# EasyEDA Pro project EasyEDAProDoc_P2303U1-electronicbox_2024-09-11.epro

# Schematic P2303U1-electronicbox
Board Name: P2303U1-main; Create Date: 2023-04-14; Company: Urli Lab; Part Number: P2303U1; Version: V1.0
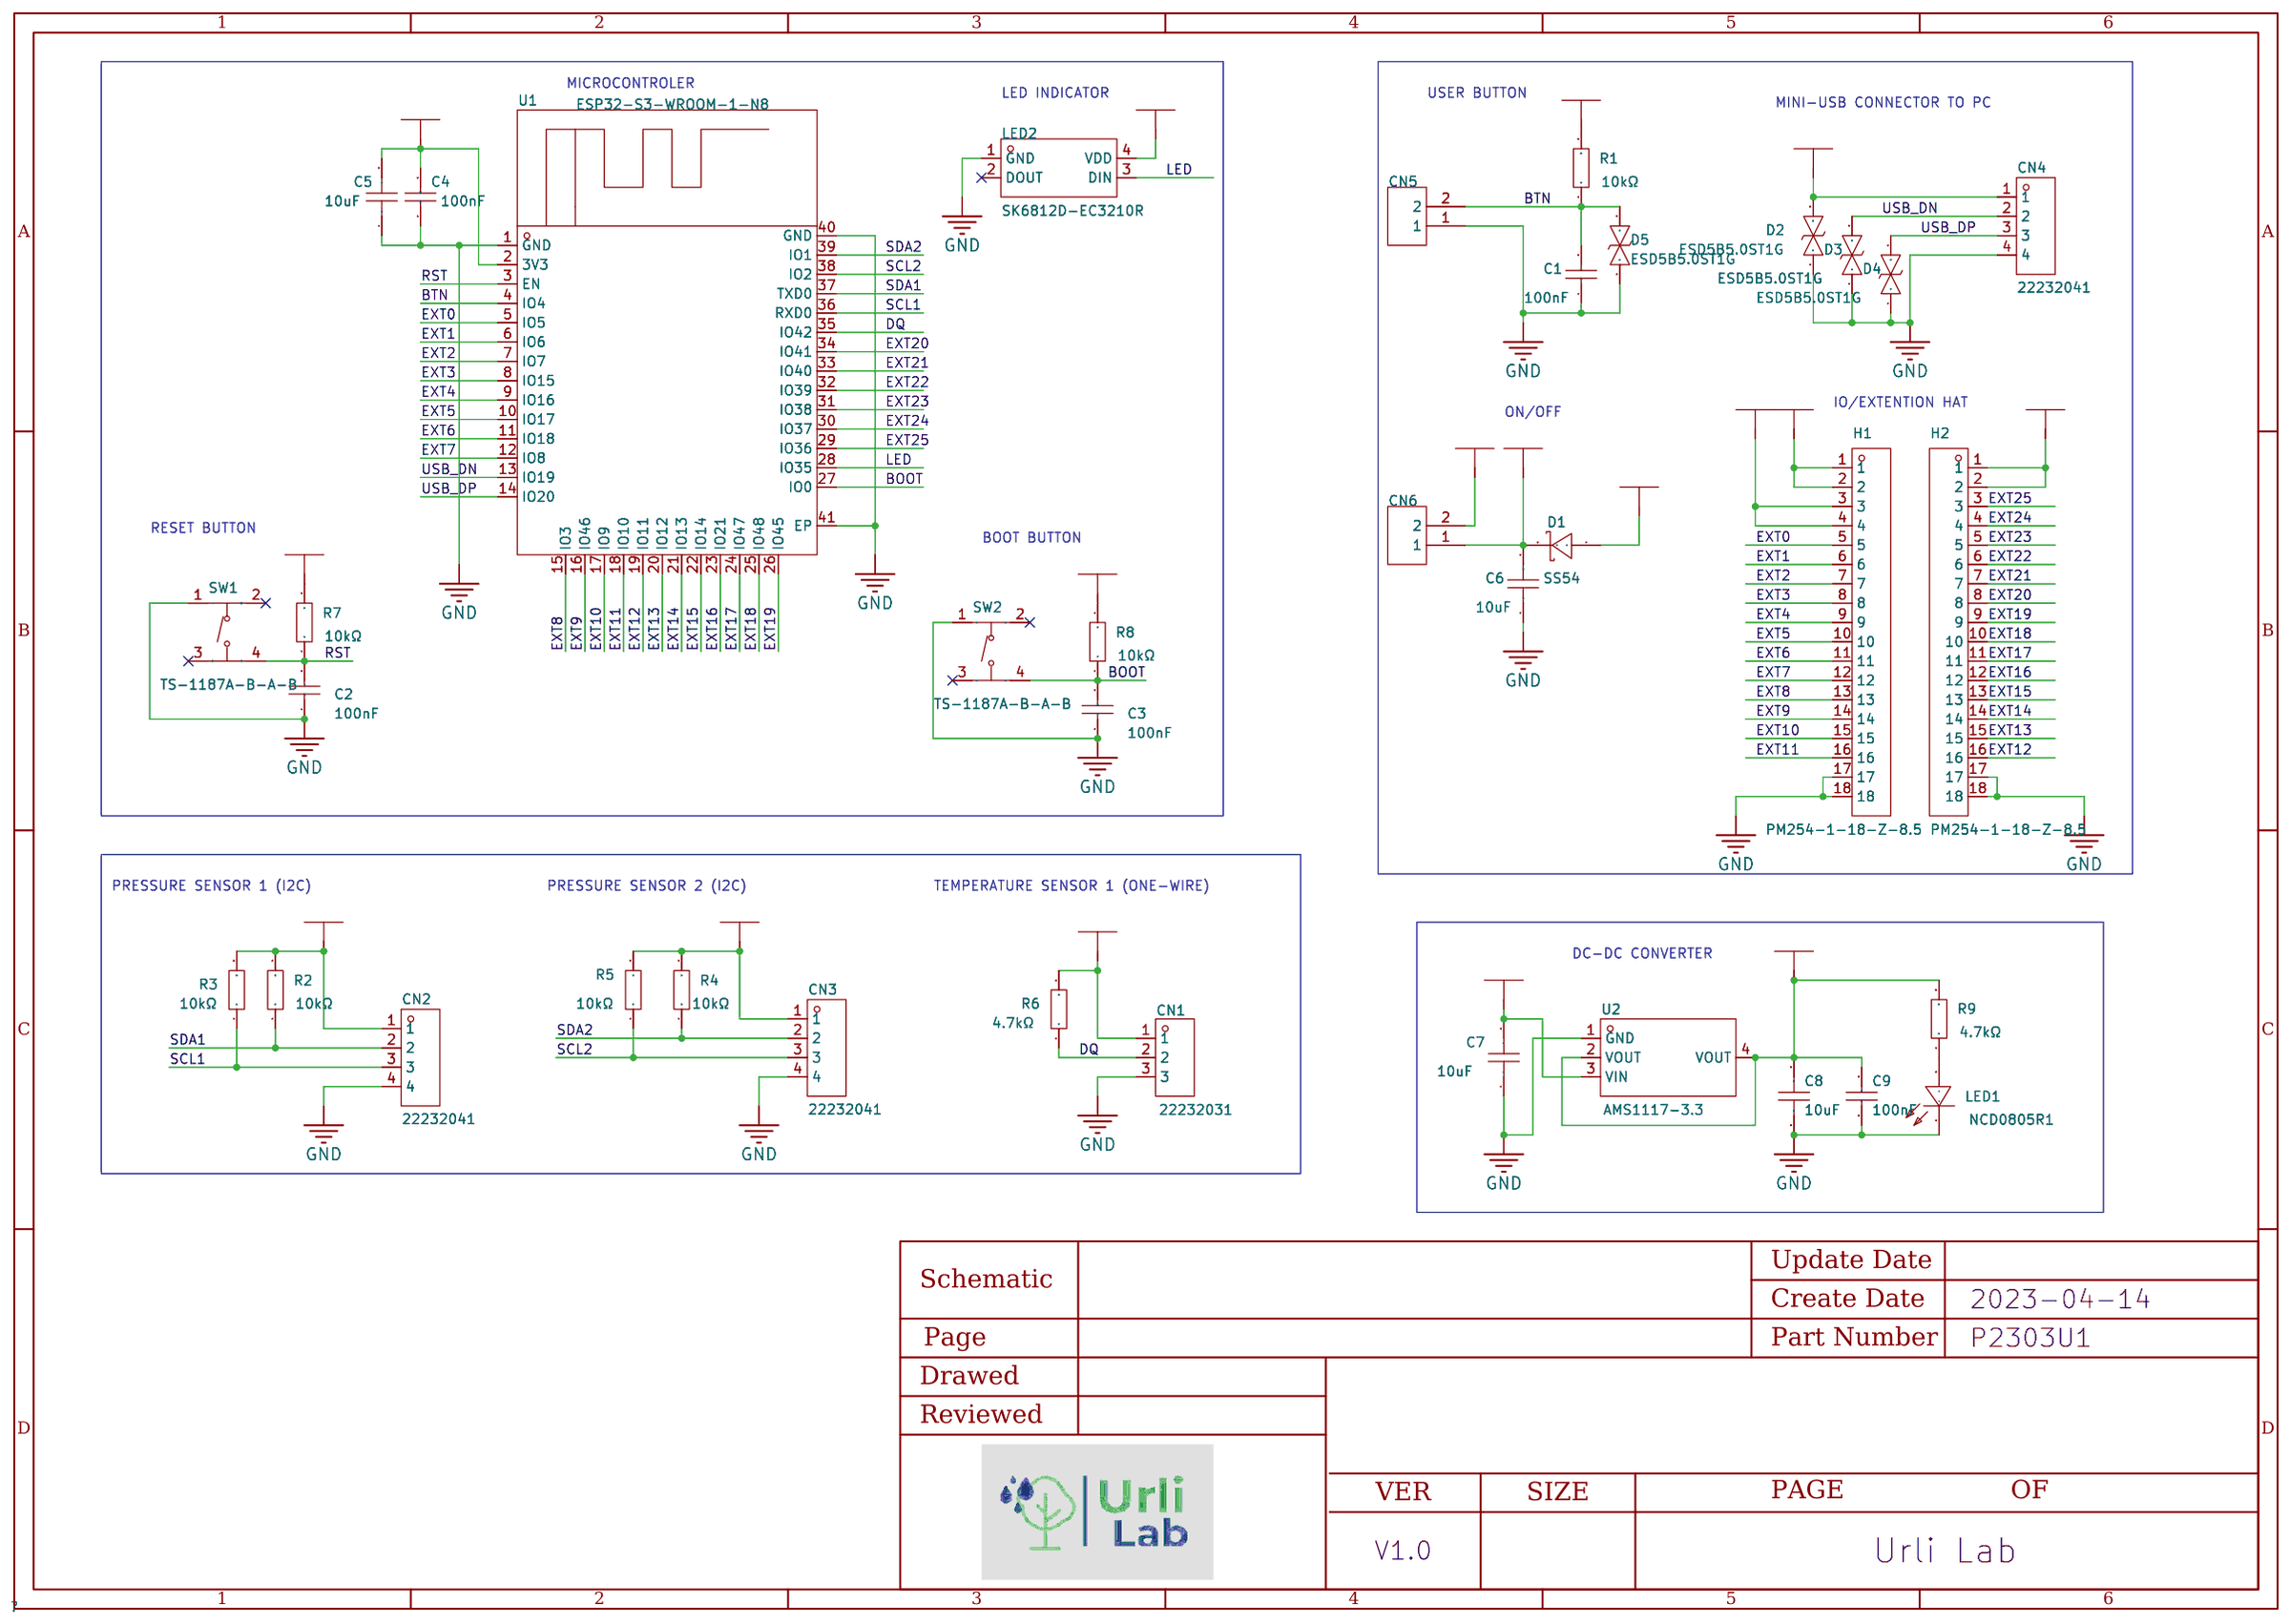
[diagram p0: schematic sheet]

## Parts
C1  100nF  [C0805]
C2  100nF  [C0805]
C3  100nF  [C0805]
C4  100nF  [C0805]
C5  10uF  [C0805]
C6  10uF  [C0805]
C7  10uF  [C0805]
C8  10uF  [C0805]
C9  100nF  [C0805]
CN1  22232031  [CONN-TH_3P-P2.54_22-23-2031]
CN2  22232041  [CONN-TH_4P-P2.54_22232041]
CN3  22232041  [CONN-TH_4P-P2.54_22232041]
CN4  22232041  [CONN-TH_4P-P2.54_22232041]
CN5  22-23-2021  [Molex-22-23-2021-Manufacturer_Recommended]
CN6  22-23-2021  [Molex-22-23-2021-Manufacturer_Recommended]
D1  SS54  [SMA_L4.4-W2.8-LS5.4-R-RD]
D2  ESD5B5.0ST1G  [SOD-523_L1.2-W0.8-LS1.6-BI]
D3  ESD5B5.0ST1G  [SOD-523_L1.2-W0.8-LS1.6-BI]
D4  ESD5B5.0ST1G  [SOD-523_L1.2-W0.8-LS1.6-BI]
D5  ESD5B5.0ST1G  [SOD-523_L1.2-W0.8-LS1.6-BI]
H1  PM254-1-18-Z-8.5  [HDR-TH_18P-P2.54-V-F]
H2  PM254-1-18-Z-8.5  [HDR-TH_18P-P2.54-V-F]
LED1  NCD0805R1  [LED0805-RD_RED]
LED2  SK6812D-EC3210R  [LED-SMD_4P_SK6812D-EC3210R]
R1  10kΩ  [R0805]
R2  10kΩ  [R0805]
R3  10kΩ  [R0805]
R4  10kΩ  [R0805]
R5  10kΩ  [R0805]
R6  4.7kΩ  [R0805]
R7  10kΩ  [R0805]
R8  10kΩ  [R0805]
R9  4.7kΩ  [R0805]
SW1  TS-1187A-B-A-B  [SW-SMD_4P-L5.1-W5.1-P3.70-LS6.5-TL-2]
SW2  TS-1187A-B-A-B  [SW-SMD_4P-L5.1-W5.1-P3.70-LS6.5-TL-2]
U1  ESP32-S3-WROOM-1-N8  [WIFIM-SMD_ESP32-S3-WROOM-1-N8]
U2  AMS1117-3.3  [SOT-223-3_L6.5-W3.4-P2.30-LS7.0-BR]

## Library data of the parts
C1-C4 C9 = CC0805KRX7R9BB104: Capacitance: Tolerance:±10% Tolerance:±10% Voltage Rated: Temperature Coefficient:; LCSC Part Name: 100nF ±10% 50V; Supplier Part: C49678; Manufacturer: YAGEO(国巨); Supplier Footprint: 0805; JLCPCB Part Class: Basic Part; Datasheet: https://atta.szlcsc.com/upload/public/pdf/source/20151026/1457707504898.pdf; Supplier: LCSC; Tolerance: ±10%
C5-C8 = GRM21BR61H106KE43L: Capacitance: Tolerance:±10% Tolerance:±10% Voltage Rated: Temperature Coefficient:; LCSC Part Name: 10uF ±10% 50V; Supplier Part: C440198; Manufacturer: muRata(村田); Supplier Footprint: 0805; JLCPCB Part Class: Basic Part; Datasheet: https://atta.szlcsc.com/upload/public/pdf/source/20191220/C440198_2DEA1B9834E321C8893F7972E9DFE5B0.pdf; Supplier: LCSC; Tolerance: ±10%
CN1 = 22232031: Reference Series:- Pitch:2.54mm Pins Structure:1x3P Number of Rows:1 Number of PINs Per Row:3 Row Spacing:- Mounting Style:- Contact Material:Brass; LCSC Part Name: 2.54mm 1x3P; Supplier Part: C234181; Manufacturer: MOLEX; Supplier Footprint: 直插,P=2.54mm; JLCPCB Part Class: Extended Part; Datasheet: https://atta.szlcsc.com/upload/public/pdf/source/20190912/C234181_096A3D100CF5A4413B41D2108E533DE6.pdf; Supplier: LCSC; Pitch: 2.54mm; Pins Structure: 1x3P; Number of Rows: 1; Number of PINs Per Row: 3; Contact Material: Brass
CN2-CN4 = 22232041: Reference Series:- Pitch:2.54mm Pins Structure:1x4P Number of Rows:1 Number of PINs Per Row:4 Row Spacing:- Gender:公型插针 Mounting Style:Straight Current Rating (Max):- Operating Temperature Range:- Operating Temperature Range:-; LCSC Part Name: 2.54mm 1x4P 直插; Supplier Part: C164168; Manufacturer: MOLEX; Supplier Footprint: 直插,P=2.54mm; JLCPCB Part Class: Extended Part; Datasheet: https://atta.szlcsc.com/upload/public/pdf/source/20180524/C164168_14DE6A7B55FCA9396291F18B21842201.pdf; Supplier: LCSC; Pitch: 2.54mm; Pins Structure: 1x4P; Number of Rows: 1; Number of PINs Per Row: 4; Gender: 公型插针; Mounting Style: Straight
CN5 CN6 = 0022232021: Field4: Headers & Wire Housings VERT PCB HDR 2P TIN FRICTION LOCK; Field5: 11.05; Field6: 538-22-23-2021; Field7: https://www.mouser.co.uk/ProductDetail/Molex/22-23-2021?qs=ILqg114nvd4YKlRlbo3yMg%3D%3D; Field8: Molex; Manufacturer: MOLEX; Supplier: LCSC; Supplier Part: C234180; Manufacturer Part: 22232021
D1 = SS54_C22452: Reverse Voltage (Vr):40V Average Rectified Current (Io):5A Forward Voltage (Vf@If):550mV@5A; LCSC Part Name: 40V 5A 550mV@5A; Supplier Part: C22452; Manufacturer: MDD; Supplier Footprint: SMA(DO-214AC); JLCPCB Part Class: Basic Part; Datasheet: https://atta.szlcsc.com/upload/public/pdf/source/20230314/529CD85F9B31F69841D3A079BC07E377.pdf; Supplier: LCSC; Reverse Voltage (Vr): 40V; Average Rectified Current (Io): 5A; Forward Voltage (Vf@If): 550mV@5A
D2-D5 = ESD5B5.0ST1G: Polarity:Bi-Directional Reverse Stand-Off Voltage (Vrwm):5V Breakdown Voltage (VBR):5.8V Clamping Voltage@Ipp:- Peak Pulse Power(Ppp)@8/20us:50W Junction Capacitance(Cj)@1MHz:32pF@1MHz Operating Temperature:-55℃~+150℃@(Tj) Operating Temperature:-55℃~+150℃; LCSC Part Name: 双向ESD; Supplier Part: C93623; Manufacturer: onsemi(安森美); Supplier Footprint: SOD-523-2; JLCPCB Part Class: Extended Part; Datasheet: https://atta.szlcsc.com/upload/public/pdf/source/20170728/C93623_1501225905857849086.PDF; Supplier: LCSC; Polarity: Bi-Directional; Reverse Stand-Off Voltage (Vrwm): 5V; Breakdown Voltage (VBR): 5.8V; Peak Pulse Power(Ppp)@8/20us: 50W; Junction Capacitance(Cj)@1MHz: 32pF@1MHz; Operating Temperature: -55℃~+150℃@(Tj)
H1 H2 = PM254-1-18-Z-8.5: Number of Rows:单排 Number of Holes:18 Pitch:2.54mm Holes Structure:1x18P Row Spacing:- Mounting Type:Straight Circular Hole / Square Hole:Square Holes Current Rating (Max):3A Voltage Rating (Max):- Holes Direction:Top Insulation Height:8.5mm Operating Temp; LCSC Part Name: 2.54mm 1x18P; Supplier Part: C2897381; Manufacturer: HCTL(华灿天禄); Supplier Footprint: 插件,P=2.54mm; JLCPCB Part Class: Extended Part; Datasheet: https://atta.szlcsc.com/upload/public/pdf/source/20210927/A587EC018F0ED68DBE3C69C90D2D513F.pdf; Supplier: LCSC; Number of Rows: 单排; Number of Holes: 18; Pitch: 2.54mm; Holes Structure: 1x18P; Mounting Type: Straight; Circular Hole / Square Hole: Square Holes; Current Rating (Max): 3A; Holes Direction: Top; Insulation Height: 8.5mm; Operating Temperature Range: -40℃~+105℃
LED1 = NCD0805R1_C84256: Emitted Color:红灯; LCSC Part Name: 红灯; Supplier Part: C84256; Manufacturer: 国星光电; Supplier Footprint: 0805; JLCPCB Part Class: Basic Part; Datasheet: https://atta.szlcsc.com/upload/public/pdf/source/20200820/C84256_F0A75A43B3EAD75808600A0514C76B99.pdf; Supplier: LCSC; Emitted Color: 红灯
LED2 = SK6812D-EC3210R: Emitted Color:RGB Diode Configuration:- Lens Color:- Dominant Wavelength:620nm~630nm；520nm~535nm；460nm~475nm Dominant Wavelength:620nm~630nm；520nm~535nm；460nm~475nm Peak Wavelength:- Color Temperature:- Color Temperature:- Forward Current:5mA Power Dissip; LCSC Part Name: RGB三色; Supplier Part: C2890041; Manufacturer: 欧思科光电; Supplier Footprint: SMD,1.1x3.2mm; JLCPCB Part Class: Extended Part; Datasheet: https://atta.szlcsc.com/upload/public/pdf/source/20210825/B6C6473DD4EB626997615BE40306D761.pdf; Supplier: LCSC; Emitted Color: RGB; Dominant Wavelength: 620nm~630nm；520nm~535nm；460nm~475nm; Forward Current: 5mA; Operating Temperature: -40℃~+80℃
R1-R5 R7 R8 = 0805W8F1002T5E: Type:Thick Film Resistors Resistance: Tolerance:±1% Tolerance:±1% Power(Watts): Temperature Coefficient:±100ppm/℃ Temperature Coefficient:±100ppm/℃ Overload Voltage (Max): Operating Temperature Range:-55℃~+155℃ Operating Temperature Range:-55℃~+155℃; LCSC Part Name: 10kΩ ±1% 125mW; Supplier Part: C17414; Manufacturer: UNI-ROYAL(厚声); Supplier Footprint: 0805; JLCPCB Part Class: Basic Part; Datasheet: https://atta.szlcsc.com/upload/public/pdf/source/20200306/C422600_1E6D84923E4A46A82E41ADD87F860B5C.pdf; Supplier: LCSC; Type: Thick Film Resistors; Tolerance: ±1%; Temperature Coefficient: ±100ppm/℃; Operating Temperature Range: -55℃~+155℃
R6 R9 = 0805W8F4701T5E: Type:Thick Film Resistors Resistance: Tolerance:±1% Tolerance:±1% Power(Watts): Temperature Coefficient:±100ppm/℃ Temperature Coefficient:±100ppm/℃ Overload Voltage (Max): Operating Temperature Range:-55℃~+155℃ Operating Temperature Range:-55℃~+155℃; LCSC Part Name: 4.7kΩ ±1% 125mW; Supplier Part: C17673; Manufacturer: UNI-ROYAL(厚声); Supplier Footprint: 0805; JLCPCB Part Class: Basic Part; Datasheet: https://atta.szlcsc.com/upload/public/pdf/source/20200306/C422600_1E6D84923E4A46A82E41ADD87F860B5C.pdf; Supplier: LCSC; Type: Thick Film Resistors; Tolerance: ±1%; Temperature Coefficient: ±100ppm/℃; Operating Temperature Range: -55℃~+155℃
SW1 SW2 = TS-1187A-B-A-B: Contact Current:50mA Voltage Rating (DC):12V Insulation Resistance:- Circuit:SPST Mounting Style:Brick nogging Actuator Style:Round Button Actuator/Cap Color:金色 With Lamp:No Operating Force:160gf Mechanical Life:100000次 Operating Temperature:-30℃~+85℃ Ope; LCSC Part Name: 5.1*5.1*1.5mm 立贴 轻触开关 防水金属头; Supplier Part: C318884; Manufacturer: XKB Connectivity(中国星坤); Supplier Footprint: SMD; JLCPCB Part Class: Basic Part; Datasheet: https://atta.szlcsc.com/upload/public/pdf/source/20200227/C318884_1F20165719E1C4CAA3E10C4C359C6E26.pdf; Supplier: LCSC; Contact Current: 50mA; Voltage Rating (DC): 12V; Circuit: SPST; Mounting Style: Brick nogging; Actuator Style: Round Button; Actuator/Cap Color: 金色; With Lamp: No; Operating Force: 160gf; Mechanical Life: 100000次; Operating Temperature: -30℃~+85℃; Switch Length: 5.1mm; Switch Width: 5.1mm; Switch Height: 1.5mm; Strike Gundam: NO
U1 = ESP32-S3-WROOM-1-N8: Supplier Part: C2913198; Manufacturer: ESPRESSIF(乐鑫); Supplier Footprint: SMD,18x25.5mm; JLCPCB Part Class: Extended Part; Datasheet: https://atta.szlcsc.com/upload/public/pdf/source/20221026/9A44C6421221D672346AAE72DF9F8146.pdf; Supplier: LCSC
U2 = AMS1117-3.3_C6186: Output Type: Output Polarity:Positive Number of Outputs:1 Maximum Input Voltage:- Output Voltage:3.3V~3.3V Output Voltage:3.3V~3.3V Dropout Voltage:1.3V@(800mA) Quiescent Current (Ground Current):- Output Current:1A Power Supply Rejection Ratio (PSRR):72d; LCSC Part Name: 正 Vout=3.3V 1A 72dB@(120Hz); Supplier Part: C6186; Manufacturer: AMS; Supplier Footprint: SOT-223; JLCPCB Part Class: Basic Part; Datasheet: https://atta.szlcsc.com/upload/public/pdf/source/20180727/C6186_7A095716F0823C02F1997A905E26C086.pdf; Supplier: LCSC; Output Polarity: Positive; Number of Outputs: 1; Output Voltage: 3.3V~3.3V; Dropout Voltage: 1.3V@(800mA); Output Current: 1A; Power Supply Rejection Ratio (PSRR): 72dB@(120Hz)

## Nets
3V3: C4.2 C5.2 C8.2 C9.2 CN1.1 CN2.1 CN3.1 H2.1 H2.2 LED2.4(VDD) R1.2 R2.2 R3.2 R4.2 R5.2 R6.2 R7.2 R8.2 R9.2 U1.2(3V3) U2.2(VOUT) U2.4(VOUT)
GND: C1.1 C2.1 C3.1 C4.1 C5.1 C6.1 C7.1 C8.1 C9.1 CN1.3 CN2.4 CN3.4 CN4.4 CN5.1 D2.1 D3.1 D4.1 D5.1 H1.17 H1.18 H2.17 H2.18 LED1.1(-) LED2.1(GND) SW1.1(A) SW2.1(A) U1.1(GND) U1.40(GND) U1.41(EP) U2.1(GND)
VBUS: CN4.1 D1.1(A) D2.2
VCC: C7.2 CN6.2 H1.1 H1.2 U2.3(VIN)
VIN: C6.2 CN6.1 D1.2(K) H1.3 H1.4
BOOT: C3.2 R8.1 SW2.4(D) U1.27(IO0)
BTN: C1.2 CN5.2 D5.2 R1.1 U1.4(IO4)
DQ: CN1.2 R6.1 U1.35(IO42)
EXT0: H1.5 U1.5(IO5)
EXT1: H1.6 U1.6(IO6)
EXT2: H1.7 U1.7(IO7)
EXT3: H1.8 U1.8(IO15)
EXT4: H1.9 U1.9(IO16)
EXT5: H1.10 U1.10(IO17)
EXT6: H1.11 U1.11(IO18)
EXT7: H1.12 U1.12(IO8)
EXT8: H1.13 U1.15(IO3)
EXT9: H1.14 U1.16(IO46)
EXT10: H1.15 U1.17(IO9)
EXT11: H1.16 U1.18(IO10)
EXT12: H2.16 U1.19(IO11)
EXT13: H2.15 U1.20(IO12)
EXT14: H2.14 U1.21(IO13)
EXT15: H2.13 U1.22(IO14)
EXT16: H2.12 U1.23(IO21)
EXT17: H2.11 U1.24(IO47)
EXT18: H2.10 U1.25(IO48)
EXT19: H2.9 U1.26(IO45)
EXT20: H2.8 U1.34(IO41)
EXT21: H2.7 U1.33(IO40)
EXT22: H2.6 U1.32(IO39)
EXT23: H2.5 U1.31(IO38)
EXT24: H2.4 U1.30(IO37)
EXT25: H2.3 U1.29(IO36)
LED: LED2.3(DIN) U1.28(IO35)
RST: C2.2 R7.1 SW1.4(D) U1.3(EN)
SCL1: CN2.3 R3.1 U1.36(RXD0)
SCL2: CN3.3 R5.1 U1.38(IO2)
SDA1: CN2.2 R2.1 U1.37(TXD0)
SDA2: CN3.2 R4.1 U1.39(IO1)
USB_DN: CN4.2 D3.2 U1.13(IO19)
USB_DP: CN4.3 D4.2 U1.14(IO20)
$1N35114: LED1.2(+) R9.1

Not connected (* = marked no-connect by the designer): LED2 2(DOUT)*; SW1 2(B)* 3(C)*; SW2 2(B)* 3(C)*

## Notes on the sheet
- MICROCONTROLER
- LED INDICATOR
- USER BUTTON
- MINI-USB CONNECTOR TO PC
- IO/EXTENTION HAT
- ON/OFF
- RESET BUTTON
- BOOT BUTTON
- PRESSURE SENSOR 1 (I2C)
- PRESSURE SENSOR 2 (I2C)
- TEMPERATURE SENSOR 1 (ONE-WIRE)
- DC-DC CONVERTER

# Board P2303U1-electronicbox
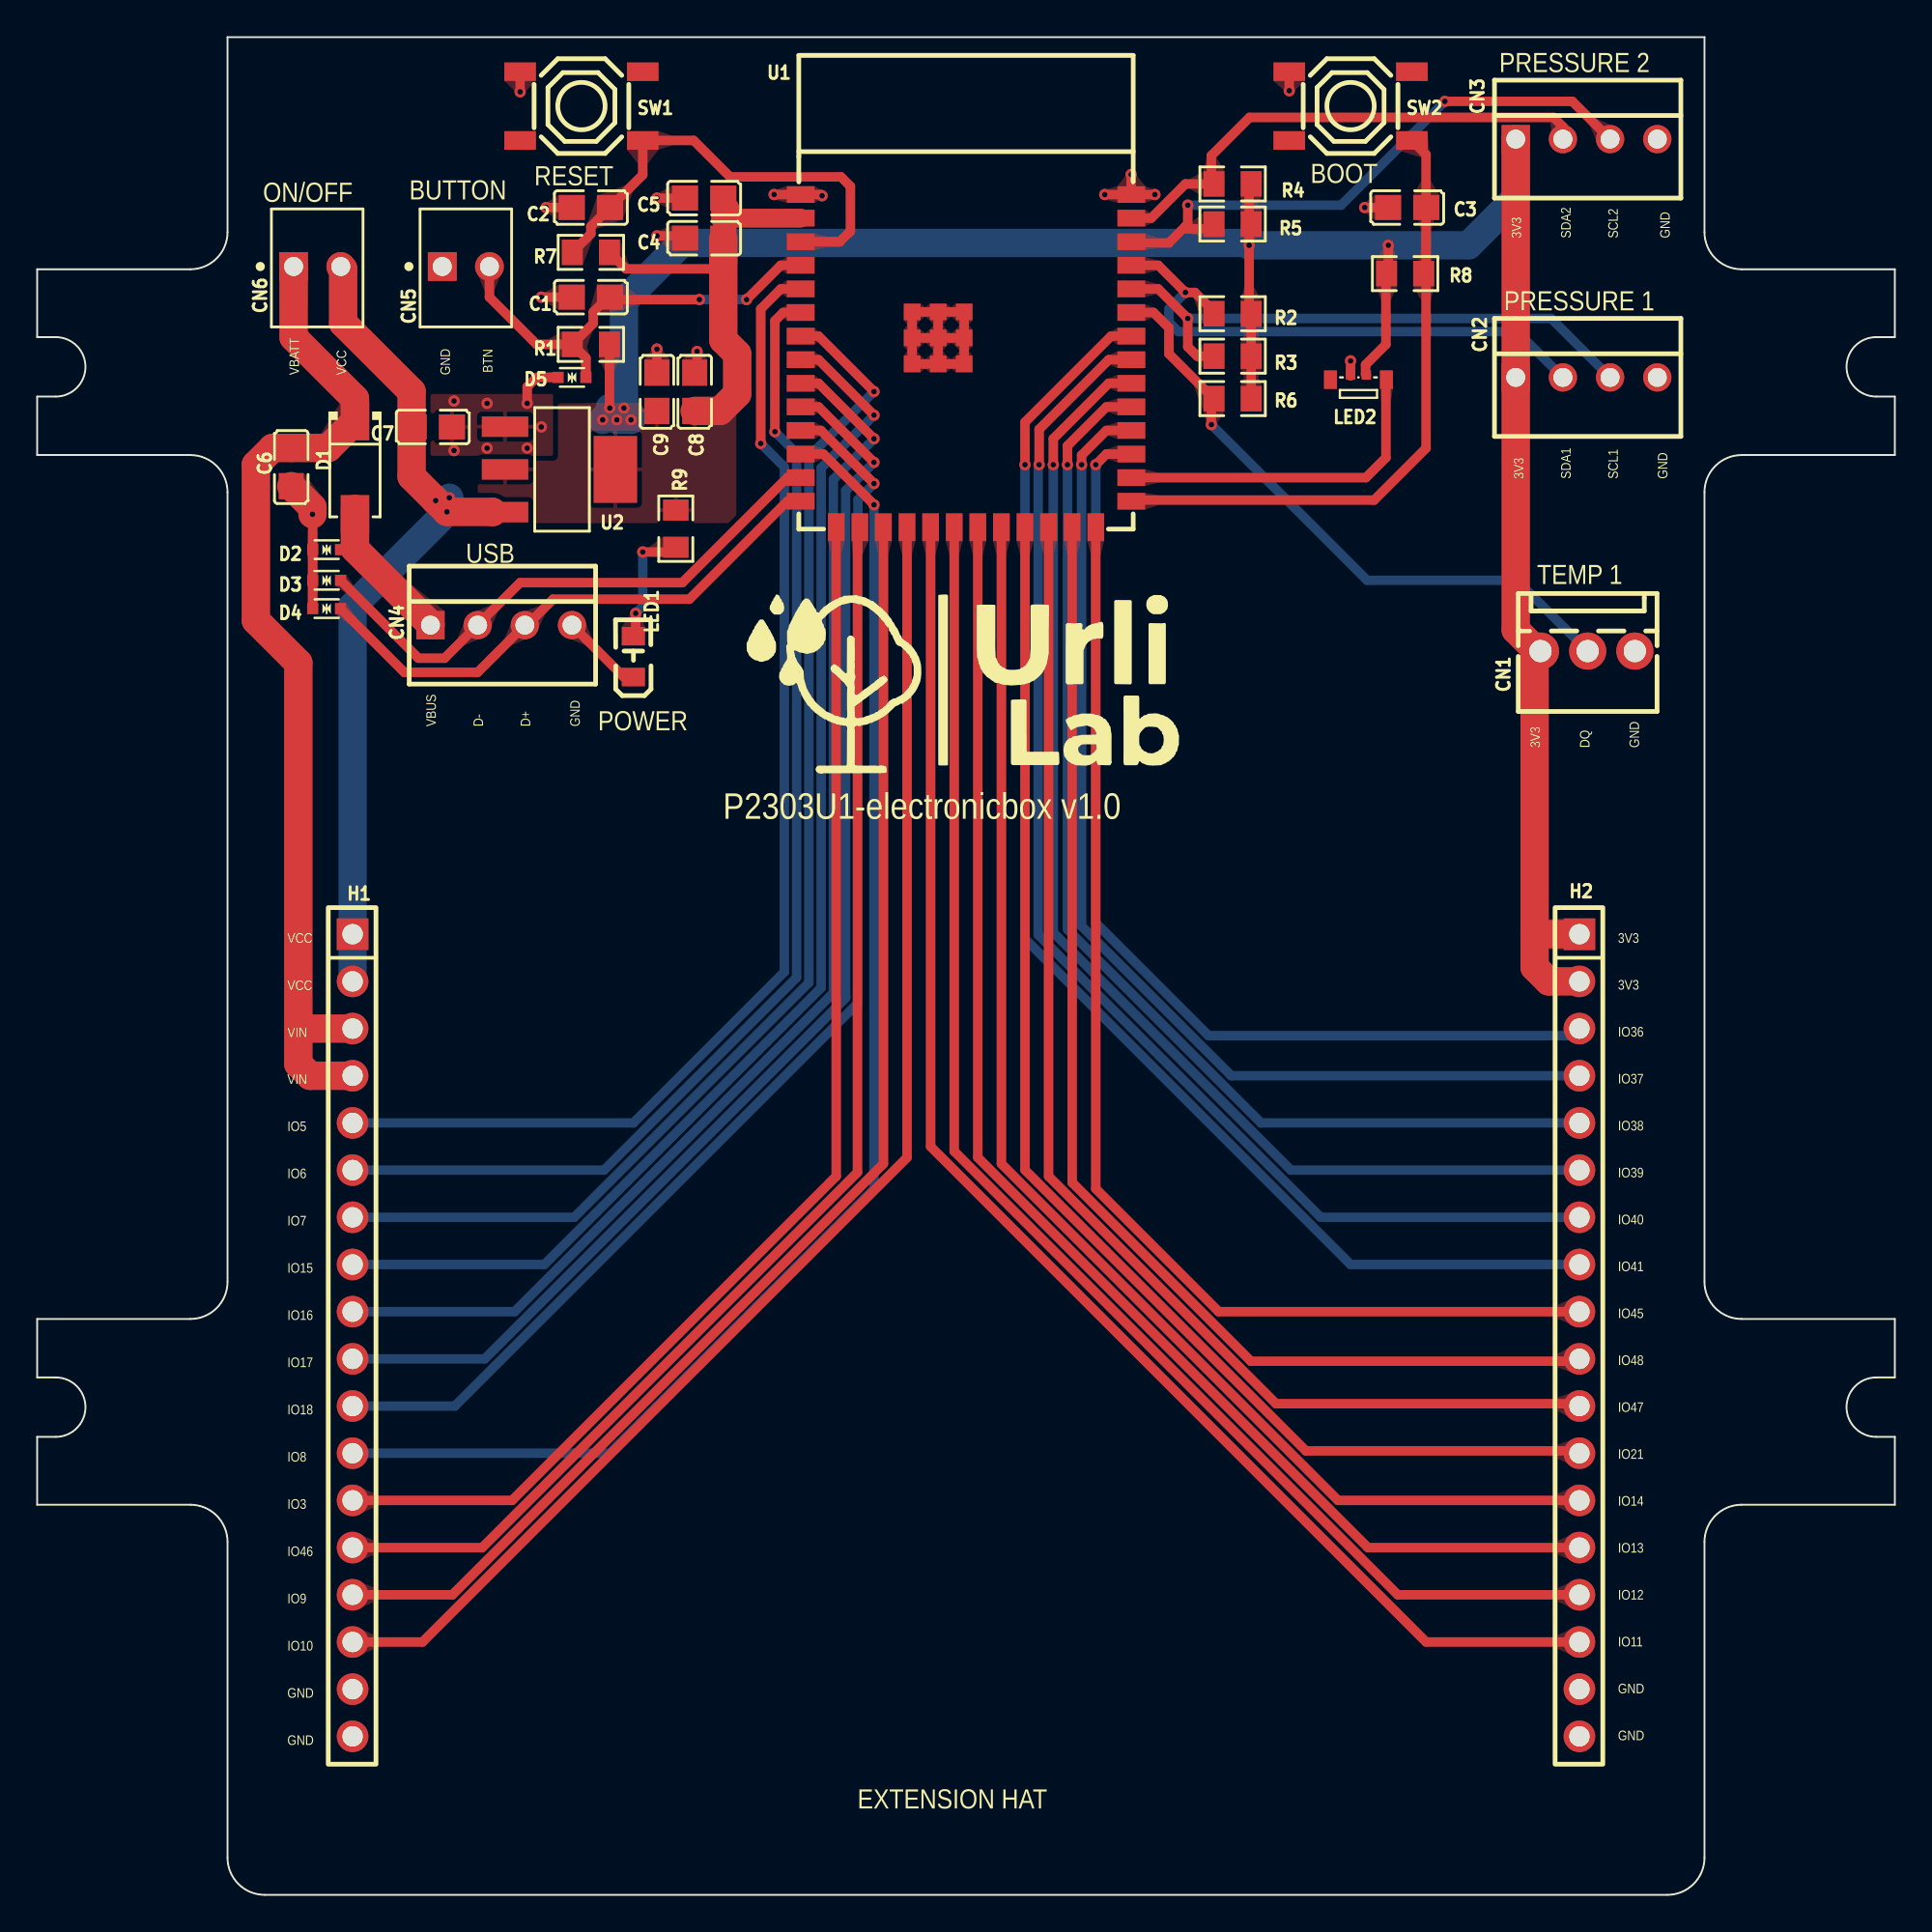
[diagram p1: board, top side]
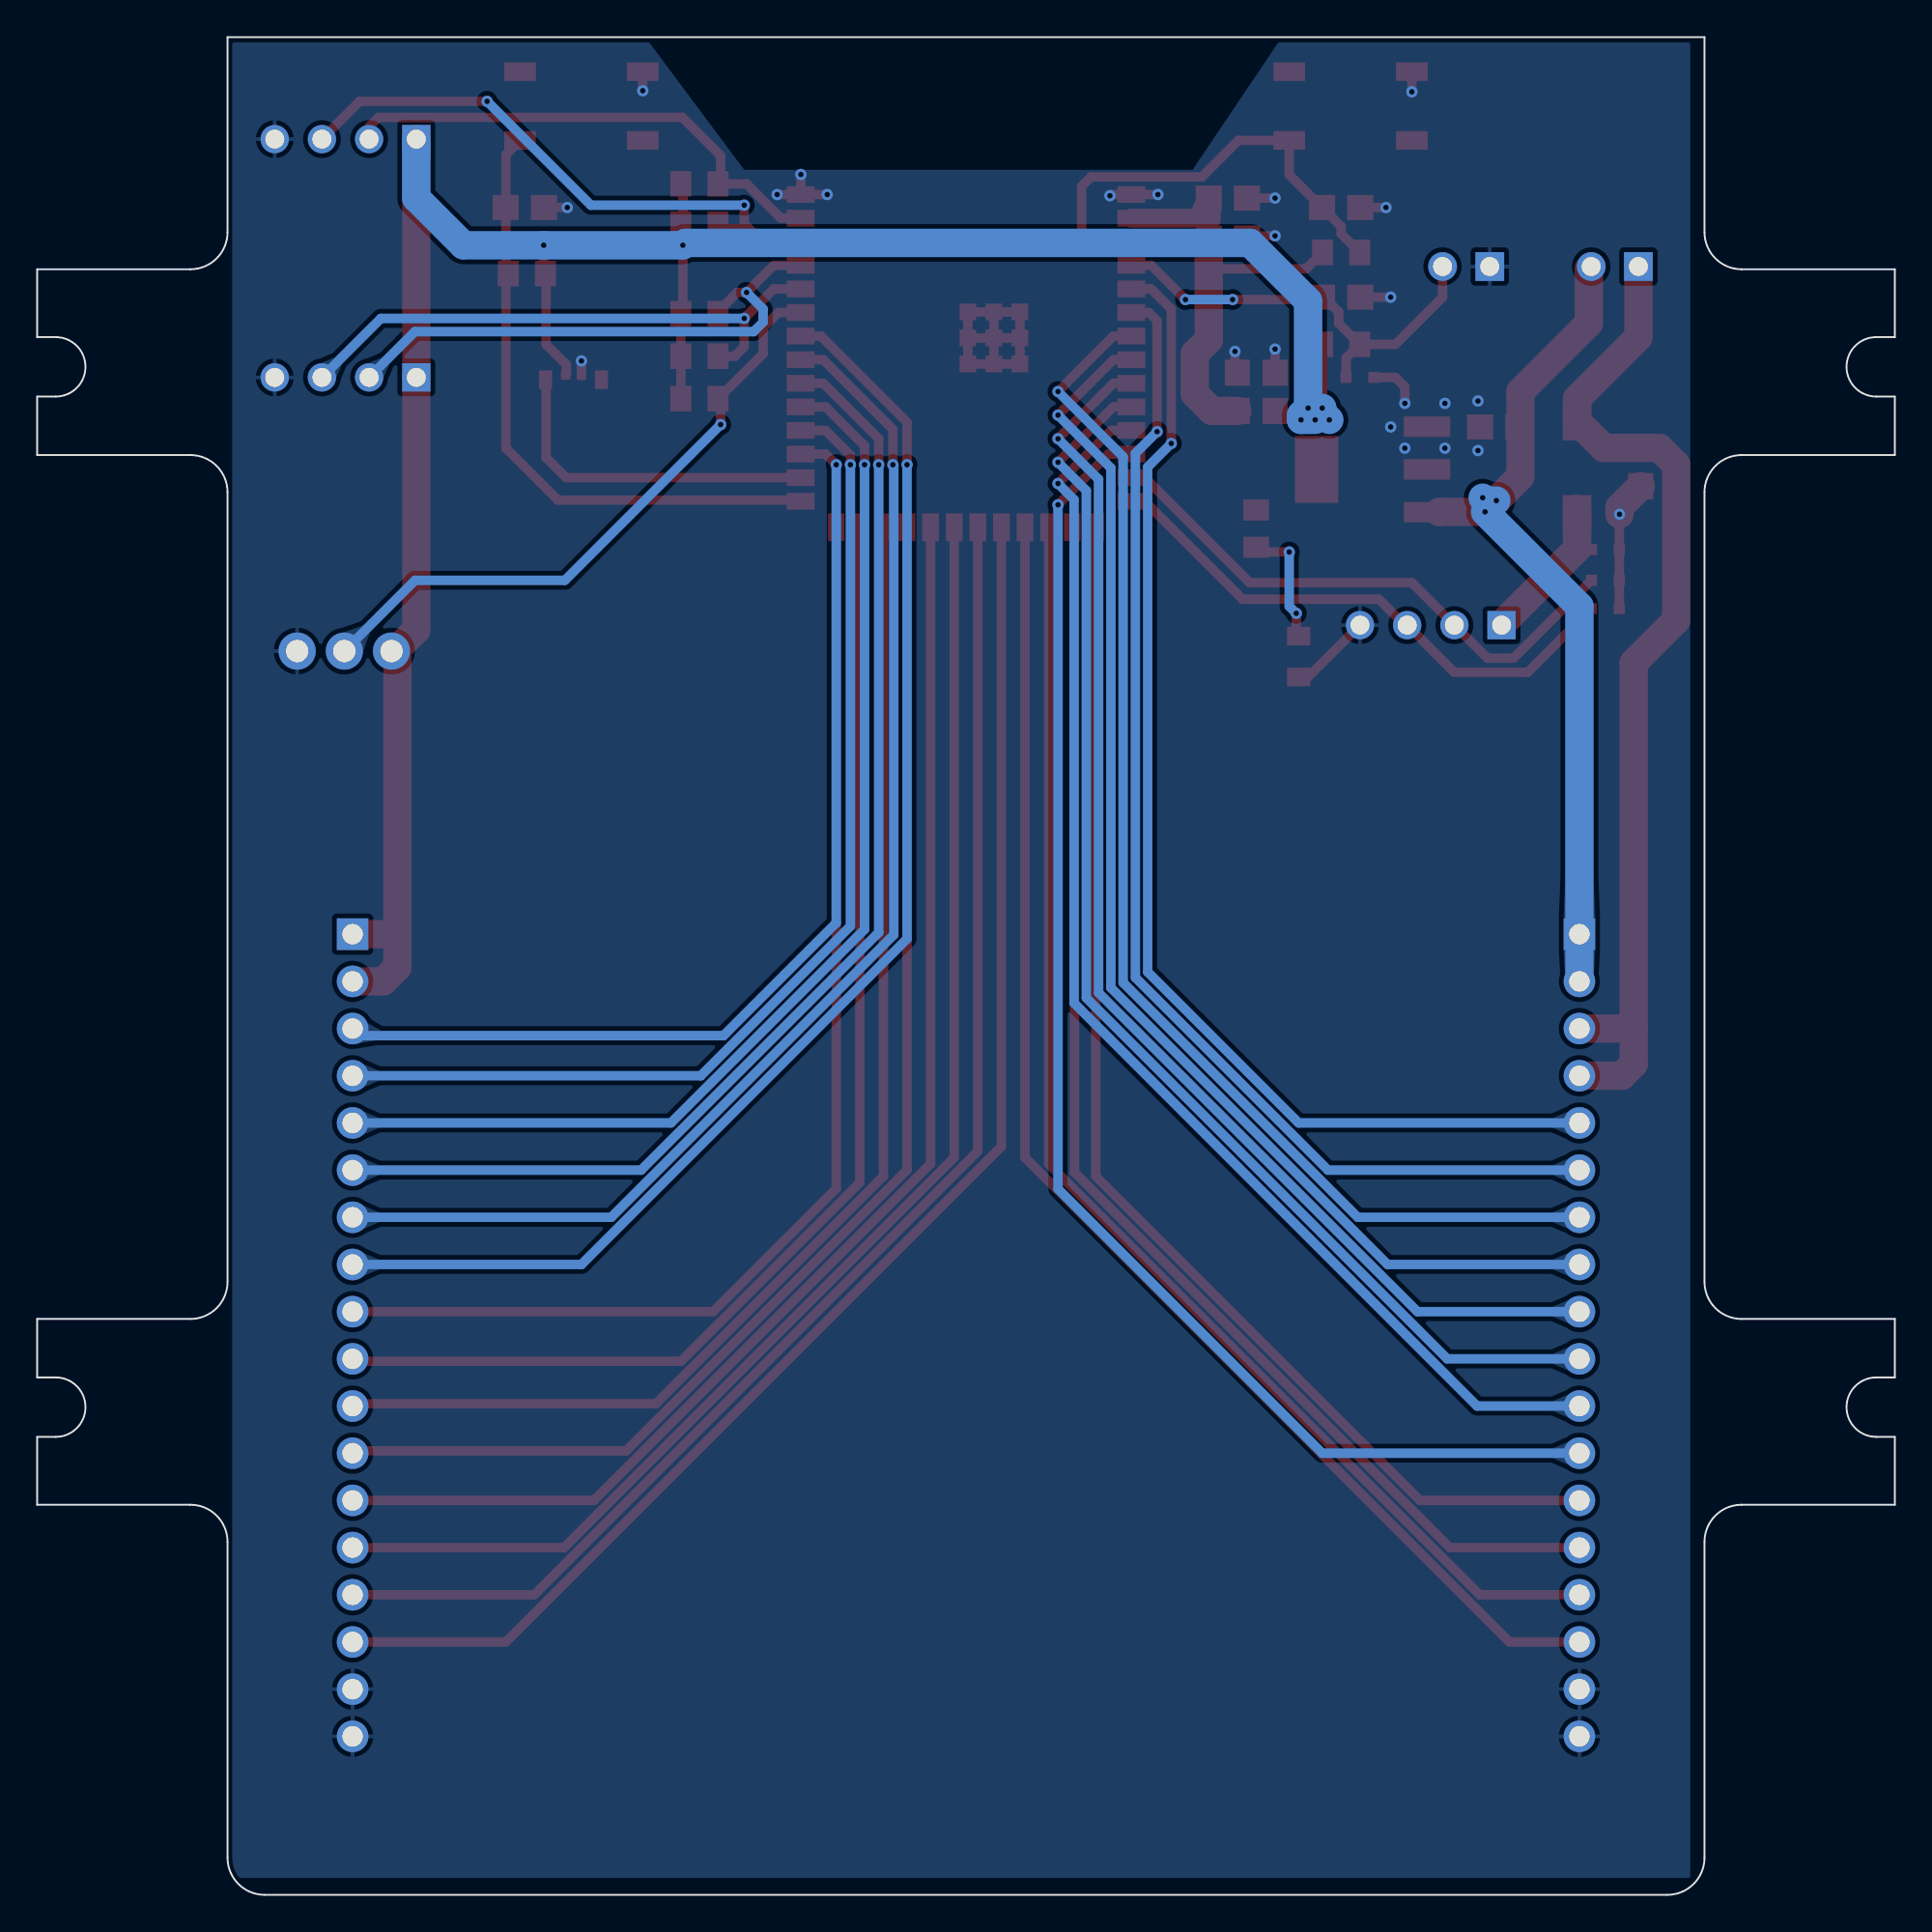
[diagram p2: board, bottom side, seen from below]

Outline 100 x 100 mm; copper layers: Top Layer, Bottom Layer. Coordinates in mm from the lower left corner of the outline.
Outline path: 0,87.5 0,83.85 1,83.85 arc(2.6,82.25) 1,80.65 0,80.65 0,77.5 8.25,77.5 arc(9.66,76.92) 10.25,75.5 10.25,33 arc(9.66,31.59) 8.25,31 0,31 0,27.85 1,27.85 arc(2.6,26.25) 1,24.65 0,24.65 0,21 8.25,21 arc(9.66,20.41) 10.25,19 10.25,2 arc(10.83,0.59) 12.25,0 87.75,0 arc(89.17,0.59) 89.75,2 89.75,19 arc(90.34,20.41) 91.75,21 100,21 100,24.65 99,24.65 arc(97.4,26.25) 99,27.85 100,27.85 100,31 91.75,31 arc(90.34,31.59) 89.75,33 89.75,75.5 arc(90.34,76.92) 91.75,77.5 100,77.5 100,80.65 99,80.65 arc(97.4,82.25) 99,83.85 100,83.85 100,87.5 91.75,87.5 arc(90.34,88.09) 89.75,89.5 89.75,100 10.25,100 10.25,89.5 arc(9.66,88.09) 8.25,87.5 0,87.5
Stack: Top Layer 0.035mm / Dielectric1 1.51mm FR4 er 4.5 / Bottom Layer 0.035mm

## Design rules (mm)
spacing safeClearance (default): track to track 0.152, other pairs 0.152 to 0.3
track width trackWidth (default): min 0.127, default 0.254, max 2.54
differential pair differentialPair (default): width min 0.127, default 0.254, max 2.54; gap min 0.152, default 0.152
via viaSize (default): diameter min 0.25, default 0.61, max 10; hole min 0.15, default 0.305, max 5.999

## Placement (name value [footprint] x y rotation side)
C1  100nF  [C0805]  29.81 86 0 top
C2  100nF  [C0805]  29.81 90.83 0 top
C3  100nF  [C0805]  73.75 90.83 0 top
C4  100nF  [C0805]  35.9 89.18 0 top
C5  10uF  [C0805]  35.9 91.34 0 top
C6  10uF  [C0805]  13.68 76.86 90 top
C7  10uF  [C0805]  21.3 79.02 180 top
C8  10uF  [C0805]  35.4 80.91 270 top
C9  100nF  [C0805]  33.36 80.91 270 top
CN1  22232031  [CONN-TH_3P-P2.54_22-23-2031]  83.46 66.95 0 top
CN2  22232041  [CONN-TH_4P-P2.54_22232041]  83.4 81.68 0 top
CN3  22232041  [CONN-TH_4P-P2.54_22232041]  83.4 94.51 0 top
CN4  22232041  [CONN-TH_4P-P2.54_22232041]  24.98 68.35 0 top
CN5  22-23-2021  [Molex-22-23-2021-Manufacturer_Recommended]  23.08 87.65 0 top
CN6  22-23-2021  [Molex-22-23-2021-Manufacturer_Recommended]  15.08 87.65 0 top
D1  SS54  [SMA_L4.4-W2.8-LS5.4-R-RD]  17.11 76.82 270 top
D2  ESD5B5.0ST1G  [SOD-523_L1.2-W0.8-LS1.6-BI]  15.58 72.41 0 top
D3  ESD5B5.0ST1G  [SOD-523_L1.2-W0.8-LS1.6-BI]  15.58 70.76 0 top
D4  ESD5B5.0ST1G  [SOD-523_L1.2-W0.8-LS1.6-BI]  15.58 69.24 0 top
D5  ESD5B5.0ST1G  [SOD-523_L1.2-W0.8-LS1.6-BI]  28.79 81.68 0 top
H1  PM254-1-18-Z-8.5  [HDR-TH_18P-P2.54-V-F]  16.98 30.12 270 top
H2  PM254-1-18-Z-8.5  [HDR-TH_18P-P2.54-V-F]  83.02 30.12 270 top
LED1  NCD0805R1  [LED0805-RD_RED]  32.09 66.66 90 top
LED2  SK6812D-EC3210R  [LED-SMD_4P_SK6812D-EC3210R]  71.13 81.69 0 top
R1  10kΩ  [R0805]  29.81 83.46 0 top
R2  10kΩ  [R0805]  64.35 85.11 0 top
R3  10kΩ  [R0805]  64.35 82.83 0 top
R4  10kΩ  [R0805]  64.35 92.1 0 top
R5  10kΩ  [R0805]  64.35 89.94 0 top
R6  4.7kΩ  [R0805]  64.35 80.54 0 top
R7  10kΩ  [R0805]  29.81 88.42 0 top
R8  10kΩ  [R0805]  73.64 87.27 180 top
R9  4.7kΩ  [R0805]  34.38 73.54 90 top
SW1  TS-1187A-B-A-B  [SW-SMD_4P-L5.1-W5.1-P3.70-LS6.5-TL-2]  29.3 96.29 0 top
SW2  TS-1187A-B-A-B  [SW-SMD_4P-L5.1-W5.1-P3.70-LS6.5-TL-2]  70.7 96.29 0 top
U1  ESP32-S3-WROOM-1-N8  [WIFIM-SMD_ESP32-S3-WROOM-1-N8]  50 82.57 0 top
U2  AMS1117-3.3  [SOT-223-3_L6.5-W3.4-P2.30-LS7.0-BR]  28.16 76.73 180 top

## Footprints (pads in the part's own frame, mm; a bottom-side part is the same pattern mirrored in y, then rotated)
C0805
  rect 1.41x1.35 smd: 1(-1.03,0) 2(1.03,0)
CONN-TH_3P-P2.54_22-23-2031
  round 2 hole 1.2: 1(-2.54,0) 2(0,0) 3(2.54,0)
CONN-TH_4P-P2.54_22232041
  rect 1.524x1.524 hole 1.02: 1(-3.81,0)
  round 1.524 hole 1.02: 2(-1.27,0) 3(1.27,0) 4(3.81,0)
HDR-TH_18P-P2.54-V-F
  rect 1.7x1.7 hole 1.1: 1(-21.59,0)
  round 1.7 hole 1.1: 2(-19.05,0) 3(-16.51,0) 4(-13.97,0) 5(-11.43,0) 6(-8.89,0) 7(-6.35,0) 8(-3.81,0) 9(-1.27,0) 10(1.27,0) 11(3.81,0) 12(6.35,0) 13(8.89,0) 14(11.43,0) 15(13.97,0) 16(16.51,0) 17(19.05,0) 18(21.59,0)
LED0805-RD_RED
  rect 1x1.25 smd: 1(-1.1,0) 2(1.1,0)
LED-SMD_4P_SK6812D-EC3210R
  rect 0.5x0.5 smd: 1(-0.425,0.125) 4(0.425,0.125)
  rect 0.7x1 smd: 2(-1.505,-0.125) 3(1.505,-0.125)
Molex-22-23-2021-Manufacturer_Recommended
  rect 1.55x1.55 hole 1.02: 1(-1.27,0)
  round 1.55 hole 1.02: 2(1.27,0)
R0805
  rect 1.133x1.377 smd: 1(-1,0) 2(1,0)
SMA_L4.4-W2.8-LS5.4-R-RD
  rect 2.062x1.539 smd: 1(2.503,0) 2(-2.503,0)
SOD-523_L1.2-W0.8-LS1.6-BI
  rect 0.6x0.6 smd: 1(-0.75,0) 2(0.75,0)
SOT-223-3_L6.5-W3.4-P2.30-LS7.0-BR
  rect 2.5x1.1 smd: 1(2.97,-2.3) 2(2.97,0) 3(2.97,2.3)
  rect 2.34x3.6 smd: 4(-2.97,0)
SW-SMD_4P-L5.1-W5.1-P3.70-LS6.5-TL-2
  rect 1.7x1 smd: 1(-3.3,1.85) 2(3.3,1.85) 3(-3.3,-1.85) 4(3.3,-1.85)
WIFIM-SMD_ESP32-S3-WROOM-1-N8
  rect 1.5x0.9 smd: 1(-8.9,8.954) 2(-8.9,7.684) 3(-8.9,6.415) 4(-8.9,5.144) 5(-8.9,3.874) 6(-8.9,2.604) 7(-8.9,1.335) 8(-8.9,0.065) 9(-8.9,-1.206) 10(-8.9,-2.475) 11(-8.9,-3.745) 12(-8.9,-5.016) 13(-8.9,-6.285) 14(-8.9,-7.556) 27(8.9,-7.556) 28(8.9,-6.285) 29(8.9,-5.016) 30(8.9,-3.745) 31(8.9,-2.475) 32(8.9,-1.206) 33(8.9,0.065) 34(8.9,1.335) 35(8.9,2.604) 36(8.9,3.874) 37(8.9,5.144) 38(8.9,6.415) 39(8.9,7.684) 40(8.9,8.954)
  rect 0.9x1.5 smd: 15(-6.985,-8.954) 16(-5.715,-8.954) 17(-4.445,-8.954) 18(-3.175,-8.954) 19(-1.905,-8.954) 20(-0.635,-8.954) 21(0.635,-8.954) 22(1.905,-8.954) 23(3.175,-8.954) 24(4.445,-8.954) 25(5.715,-8.954) 26(6.985,-8.954)
  rect 0.9x0.9 smd: 41(-2.9,2.635) 41(-2.9,1.235) 41(-2.9,-0.165) 41(-1.5,2.635) 41(-1.5,1.235) 41(-1.5,-0.165) 41(-0.1,2.635) 41(-0.1,1.235) 41(-0.1,-0.165)

## Nets
As in the schematic.

Pads without a net: LED2 2; SW1 2 3; SW2 2 3

## Via types
v1: diameter 0.61, hole 0.305, Top Layer to Bottom Layer, 56 vias

## Routing (per net, layer and track width the routed paths; a pad name or vN(x,y) marks a point on that pad's centre or on a via; arc(x,y) is an arc through that point)
3V3: length 157.8
  Top Layer w0.508: v1(72.73,88.8) 72.73,87.27 R8.2 72.61,87.24 72.61,83.46 71.51,82.36 71.51,81.85 LED2.4 ; 65.22,91.59 65.24,91.57 v1(65.24,88.8) 65.24,84.57 65.35,84.46 R3.2 R6.2 ; v1(30.82,80.03) 30.81,80.05 R1.2 ; R7.2 31.7,87.53 36.54,87.53 36.93,87.92
  Top Layer w1.016: 36.93,90.83 37.05,90.72 ; 37.05,90.26 U1.2
  Top Layer w1.524: C8.2 36.76,79.88 37.68,80.8 37.68,82.95 36.93,83.7 C4.2 ; 80.61,51.71 80.61,66.63 CN1.1 80.73,66.95 79.59,68.1 CN2.1 CN3.1 ; 80.61,51.71 80.61,49.93 81.37,49.17 H2.2 ; 80.61,51.71 H2.1 ; 37.05,90.26 37.05,90.72
  Bottom Layer w1.524: CN3.1 79.59,91.34 77.05,88.8 v1(72.73,88.8) v1(65.24,88.8) 65.11,88.92 34.71,88.92 31.59,85.8 v1(31.59,80.03) ; v1(31.59,80.03) 31.97,79.65 v1(31.97,79.4) v1(31.2,79.4) ; v1(31.59,80.03) v1(30.82,80.03) 30.82,79.78 v1(30.44,79.4)
GND: length 50.3
  Top Layer w0.508: v1(58.89,92.61) 58.89,91.54 U1.40 ; U1.41 U1.41 ; U1.41 U1.41 U1.41 ; U1.41 U1.41 U1.41 ; CN4.4 31.59,65.56 LED1.1 ; U1.41 U1.41 ; U1.41 U1.41 ; U1.41 U1.41 ; v1(71.46,90.83) 72.34,90.83 72.72,91.21 ; v1(42.25,91.46) 42.19,91.53 U1.1 v1(39.67,91.53) ; v1(70.7,82.57) 70.7,81.77 ; v1(33.36,83.21) C9.1 ; v1(60.17,91.53) U1.40 ; U1.40 v1(57.47,91.53) ; C8.1 35.52,82.07 v1(35.52,83.08) ; v1(26,97.06) SW1.1 ; U1.41 U1.41 47.1,84.51 U1.41 ; D5.1 26.89,81.68 26.38,81.18 v1(26.38,80.29) ; 14.83,74.31 D2.1 D3.1 D4.1 ; v1(27.14,86) C1.1 ; v1(33.36,89.3) 34.75,89.3 C4.1 ; U1.41 U1.41 U1.41 ; v1(67.4,97.12) SW2.1 ; v1(27.39,90.83) C2.1 ; C5.1 v1(33.36,91.34)
  Top Layer w1.524: C6.1 14.82,74.69 v1(14.82,74.32)
  vias: v1(22.44,80.41) v1(22.44,77.75) v1(24.22,80.29) v1(24.22,77.87) v1(26.38,77.87) v1(27.14,79.02)
VBUS: length 7.9
  Top Layer w1.524: 17.11,74.61 17.11,72.45 21.17,68.39 21.17,68.35
VCC: length 46.2
  Top Layer w1.524: CN6.2 16.47,87.53 16.47,84.61 20.16,80.92 20.16,76.35 v1(21.45,75.05) v1(22.06,74.45) 24.51,74.45 24.52,74.43
  Bottom Layer w1.524: H1.2 H1.1 16.98,69.37 v1(22.06,74.45) ; v1(22.19,75.21) 22.03,75.05 v1(21.45,75.05)
VIN: length 55.3
  Top Layer w1.524: 14.06,46.63 H1.3 ; 14.06,46.63 14.06,44.73 14.69,44.09 H1.4 ; 14.06,46.63 14.06,66.32 11.77,68.6 11.77,76.99 12.68,77.89 C6.2 15.67,77.89 D1.2 17.11,80.54 13.81,83.84 CN6.1
BOOT: length 33.9
  Top Layer w0.508: U1.27 58.96,75.08 71.97,75.08 74.76,77.87 74.76,93.68 SW2.4
BTN: length 23.7
  Top Layer w0.508: U1.4 40.03,87.72 v1(38.19,85.88) ; C1.2 30.96,85.88 v1(35.65,85.88) ; R1.1 29.93,84.59 29.93,85.2 30.73,86 ; R1.1 26.89,83.46 24.35,86 CN5.2 ; R1.1 29.54,82.73 D5.2
  Bottom Layer w0.508: v1(35.65,85.88) v1(38.19,85.88)
DQ: length 33.8
  Top Layer w0.508: v1(63.21,79.14) 63.21,80.67 60.92,82.95 60.92,84.35 60.1,85.18 U1.35
  Bottom Layer w0.508: v1(63.21,79.14) 71.59,70.76 79.65,70.76 CN1.2
EXT0: length 64.6
  Top Layer w0.508: U1.5 40.03,86.45 38.95,85.37 v1(38.95,78.13)
  Bottom Layer w0.508: v1(38.95,78.13) 40.22,76.86 40.22,49.68 32.09,41.55 17.75,41.55
EXT1: length 65.6
  Top Layer w0.508: U1.6 40.16,85.18 39.71,84.73 v1(39.71,78.76)
  Bottom Layer w0.508: H1.6 30.52,39.01 40.88,49.38 40.88,77.59 v1(39.71,78.76)
EXT2: length 68.2
  Top Layer w0.508: v1(45.05,80.92) 42.06,83.91 U1.7
  Bottom Layer w0.508: H1.7 28.91,36.47 41.54,49.1 41.54,77.42 v1(45.05,80.92)
EXT3: length 68.6
  Top Layer w0.508: v1(45.05,79.65) 42.06,82.64 U1.8
  Bottom Layer w0.508: v1(45.05,79.65) 42.2,76.81 42.2,48.83 27.3,33.93 H1.8
EXT4: length 68.9
  Top Layer w0.508: v1(45.05,78.38) 42.06,81.37 U1.9
  Bottom Layer w0.508: H1.9 25.7,31.39 42.86,48.56 42.86,76.2 v1(45.05,78.38)
EXT5: length 69.2
  Top Layer w0.508: v1(45.05,77.11) 42.06,80.1 U1.10
  Bottom Layer w0.508: v1(45.05,77.11) 43.52,75.59 43.52,48.28 24.09,28.85 H1.10
EXT6: length 69.6
  Top Layer w0.508: v1(45.05,75.97) 42.19,78.83 U1.11
  Bottom Layer w0.508: v1(45.05,75.97) 44.18,75.11 44.18,48.01 22.49,26.31 H1.11
EXT7: length 75.9
  Top Layer w0.508: U1.12 42.33,77.56 45.05,74.84 v1(45.05,74.83)
  Bottom Layer w0.508: H1.12 30.82,23.77 45.05,38 v1(45.05,74.83)
EXT8: length 67.4
  Top Layer w0.508: U1.15 43.01,38.68 25.56,21.23 17.75,21.23
EXT9: length 70.3
  Top Layer w0.508: H1.14 23.96,18.69 44.16,38.89 44.16,73.49 U1.16
EXT10: length 72.4
  Top Layer w0.508: U1.17 45.56,39.36 22.35,16.15 H1.15
EXT11: length 74.6
  Top Layer w0.508: U1.18 46.82,39.69 20.75,13.61 H1.16
EXT12: length 79.3
  Top Layer w0.508: U1.19 48.09,40.28 74.76,13.61 H2.16
EXT13: length 77.1
  Top Layer w0.508: U1.20 49.37,40.03 73.24,16.15 H2.15
EXT14: length 75
  Top Layer w0.508: U1.21 50.63,39.69 71.63,18.69 H2.14
EXT15: length 72.9
  Top Layer w0.508: U1.22 51.91,39.36 70.03,21.23 H2.13
EXT16: length 70.8
  Top Layer w0.508: H2.12 82.89,23.9 68.3,23.9 53.18,39.02 U1.23
EXT17: length 68.6
  Top Layer w0.508: U1.24 54.44,38.68 66.69,26.44 82.89,26.44 H2.11
EXT18: length 66.6
  Top Layer w0.508: U1.25 55.72,38.35 65.34,28.73 82.89,28.73 H2.10
EXT19: length 64.4
  Top Layer w0.508: U1.26 56.99,38.01 63.6,31.39 H2.9
EXT20: length 72.6
  Top Layer w0.508: v1(53.18,76.99) 53.18,79.27 57.81,83.91 U1.34
  Bottom Layer w0.508: H2.8 70.7,33.93 53.18,51.46 v1(53.18,76.99)
EXT21: length 69.2
  Top Layer w0.508: U1.33 57.68,82.64 53.94,78.89 v1(53.94,76.99)
  Bottom Layer w0.508: v1(53.94,76.99) 53.89,76.94 53.89,51.68 69.09,36.47 H2.7
EXT22: length 65.6
  Top Layer w0.508: U1.32 57.68,81.37 54.7,78.38 v1(54.7,76.99)
  Bottom Layer w0.508: H2.6 67.49,39.01 54.7,51.8 v1(54.7,76.99)
EXT23: length 62.2
  Top Layer w0.508: U1.31 57.56,80.1 55.46,78 v1(55.46,76.99)
  Bottom Layer w0.508: v1(55.46,76.99) 55.46,51.97 65.88,41.55 H2.5
EXT24: length 58.7
  Top Layer w0.508: U1.30 57.56,78.83 56.22,77.49 v1(56.22,76.99)
  Bottom Layer w0.508: v1(56.22,76.99) 56.22,52.15 64.28,44.09 H2.4
EXT25: length 55.5
  Top Layer w0.508: v1(56.99,76.99) 57.56,77.56 U1.29
  Bottom Layer w0.508: v1(56.99,76.99) 56.99,52.32 63.05,46.25 82.64,46.25 H2.3
LED: length 18.1
  Top Layer w0.508: U1.28 71.53,76.29 72.61,77.37 72.61,81.32
RST: length 25.1
  Top Layer w0.508: U1.3 43.21,88.99 43.78,89.56 43.78,91.97 43.27,92.48 37.3,92.48 35.34,94.44 SW1.4 32.6,92.59 C2.2 30.82,90.83 29.81,89.81 29.81,89.42 R7.1
SCL1: length 30.9
  Top Layer w0.508: R3.1 62.45,82.83 61.94,83.34 v1(61.94,84.86) 60.35,86.45 U1.36
  Bottom Layer w0.508: v1(61.94,84.86) 81.5,84.86 CN2.3
SCL2: length 32.2
  Top Layer w0.508: 61.81,89.81 61.94,89.94 v1(61.94,90.96) ; 61.81,89.81 61.81,89.69 63.1,89.69 R5.1 ; 61.81,89.81 60.92,88.92 58.96,88.92 U1.38 ; v1(75.78,96.54) 82.64,96.54 CN3.3
  Bottom Layer w0.508: v1(75.78,96.54) 70.19,90.96 v1(61.94,90.96)
SDA1: length 30
  Top Layer w0.508: U1.37 60.35,87.72 v1(61.81,86.26) 62.32,86.26 63.46,85.11
  Bottom Layer w0.508: v1(61.81,86.26) 60.92,85.37 60.92,84.66 61.43,84.15 79.67,84.15 CN2.2
SDA2: length 27.4
  Top Layer w0.508: U1.39 59.97,90.26 61.81,92.1 R4.1 63.21,92.24 63.21,93.62 65.27,95.68 81.62,95.68 82.13,95.17 CN3.2
USB_DN: length 30.5
  Top Layer w0.508: U1.13 40.38,76.29 34.73,70.64 26,70.64 CN4.2 21.93,66.57 20.52,66.57 D3.2
USB_DP: length 30
  Top Layer w0.508: D4.2 19.76,65.81 23.71,65.81 26.25,68.35 26.38,68.35 27.78,69.75 35.11,69.75 40.38,75.02 U1.14
$1N35114: length 6.6
  Top Layer w0.508: R9.1 34.12,72.29 v1(32.6,72.29) ; v1(32.22,68.98) 32.22,67.88 LED1.2
  Bottom Layer w0.508: v1(32.6,72.29) 32.6,69.37 v1(32.22,68.98)

## Copper pours and planes (outline as drawn; the poured copper is in the pictures)
3V3 on Top Layer: 23.72,73.83 37.64,73.83 37.64,80.37 28.03,80.29 28.03,77.49 23.71,77.49
GND on Top Layer: 21.04,80.79 27.78,80.79 27.78,77.46 21.04,77.46
GND on Bottom Layer: 89.5,0.91 11.01,0.91 11.01,99.72 89.5,99.72

Small or netless copper shapes (teardrops, artwork), in the pictures only: 149 on Top Layer, 20 on Bottom Layer

## Text on the board
Top Silkscreen Layer: VBATT | VCC | VBUS | GND | D- | BTN | D+ | 3V3 | SDA2 | SDA1 | DQ | SCL2 | SCL1 | VIN | IO5 | IO6 | IO7 | IO15 | IO16 | IO17 | IO18 | IO8 | IO3 | IO46 | IO9 | IO10 | IO36 | IO37 | IO38 | IO39 | IO40 | IO41 | IO45 | IO48 | IO47 | IO21 | IO14 | IO13 | IO12 | IO11 | ON/OFF | BUTTON | USB | RESET | POWER | EXTENSION HAT | BOOT | PRESSURE 2 | PRESSURE 1 | TEMP 1 | P2303U1-electronicbox v1.0
